# EAGLE schematic Master (EAGLE 9.6.2)
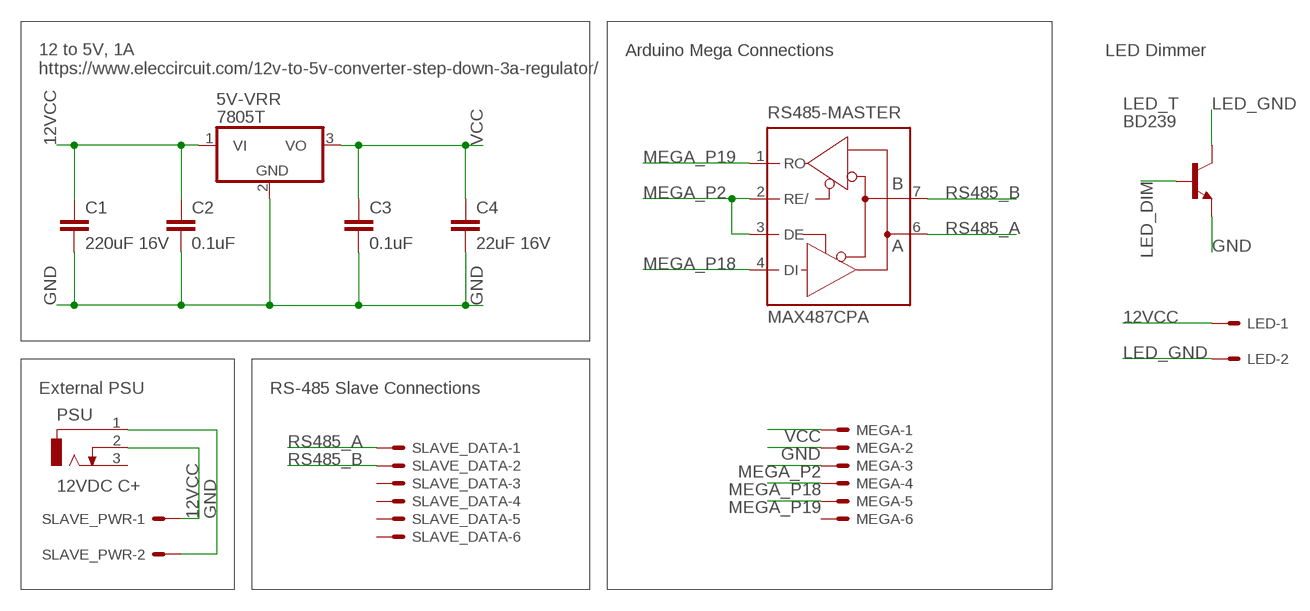
[diagram p0: schematic, sheet 1]

## Parts
5V-VRR  7805T  [TO220H]
C1  220uF 16V  C-EU025-025X050  [C025-025X050]
C2  0.1uF  C-EU025-025X050  [C025-025X050]
C3  0.1uF  C-EU025-025X050  [C025-025X050]
C4  22uF 16V  C-EU025-025X050  [C025-025X050]
LED  KK-156-2  [KK-156-2]
LED_T  BD239  [TO220]
MEGA  22-23-2061  [22-23-2061]
PSU  12VDC C+  DCJ0202  [DCJ0202]
RS485-MASTER  MAX487CPA  [DIL08]
SLAVE_DATA  22-23-2061  [22-23-2061]
SLAVE_PWR  KK-156-2  [KK-156-2]

## Nets
12VCC [5A]: 5V-VRR.1(VI) C1.1 C2.1 LED.1 PSU.2 SLAVE_PWR.1
GND: 5V-VRR.2(GND) C1.2 C2.2 C3.2 C4.2 LED_T.3(E) MEGA.2 PSU.1 SLAVE_PWR.2
LED_DIM: LED_T.1(B)
LED_GND: LED.2 LED_T.2(C)
MEGA_P2: MEGA.3 RS485-MASTER.2(RE/) RS485-MASTER.3(DE)
MEGA_P18: MEGA.4 RS485-MASTER.4(DI)
MEGA_P19: MEGA.5 RS485-MASTER.1(RO)
RS485_A: RS485-MASTER.6(A) SLAVE_DATA.1
RS485_B: RS485-MASTER.7(B) SLAVE_DATA.2
VCC: 5V-VRR.3(VO) C3.1 C4.1 MEGA.1
Unconnected: MEGA.6 PSU.3 SLAVE_DATA.3 SLAVE_DATA.4 SLAVE_DATA.5 SLAVE_DATA.6

## Notes on the sheet
- Arduino Mega Connections | LED Dimmer
- 12 to 5V, 1A
  https://www.eleccircuit.com/12v-to-5v-converter-step-down-3a-regulator/
- External PSU | RS-485 Slave Connections

## Power pins joined to a net without a drawn wire
GND: RS485-MASTER.5(GND)
VCC: RS485-MASTER.8(VCC)

## Library data of the parts
5V-VRR = linear:78*: Positive VOLTAGE REGULATOR Source: http://cache.national.com/ds/LM/LM78L05.pdf http://www.fairchildsemi.com/ds/LM/LM7805.pdf
C1-C4 = rcl:C-EU: CAPACITOR, European symbol; SPICEPREFIX: C
LED SLAVE_PWR = con-molex:KK-156-2: KK 156 HEADER Source: http://www.molex.com/pdm_docs/sd/026604100_sd.pdf; MF: MOLEX; OC_FARNELL: unknown; OC_NEWARK: unknown
LED_T = transistor-neu-to92:BD239: NPN TRANSISTOR Source: http://www.fairchildsemi.com/ds/BD/BD239C.pdf
MEGA SLAVE_DATA = con-molex:22-23-2061: .100" (2.54mm) Center Header - 6 Pin; MF: MOLEX; MPN: 22-23-2061; OC_FARNELL: 1462922; OC_NEWARK: 27C1933
PSU = con-jack:DCJ0202: DC POWER JACK Source: DCJ0202.pdf; OC_FARNELL: unknown; OC_NEWARK: unknown
RS485-MASTER = A10 Library:MAX487CPA: RS485 TRANSEIVER; MPN: MAX487CPA; OC_FARNELL: unknown; OC_NEWARK: unknown

## Net classes
0 default: width 0.152 mm, drill 0.254 mm, clearance 0.152 mm
1 5A: width 2.794 mm, drill 0.254 mm, clearance 0.152 mm